# EAGLE design cfg-deb-board (EAGLE 5.11)
DRAWN_BY: Alexios; PROJECT_NAME: CFT Mini-Computer; REVISION: Rev A; SHEET_DESCRIPTION: Debugging Card; SIMULATION_FILENAME: N/A; URL: http://www.bedroomlan.org/cft
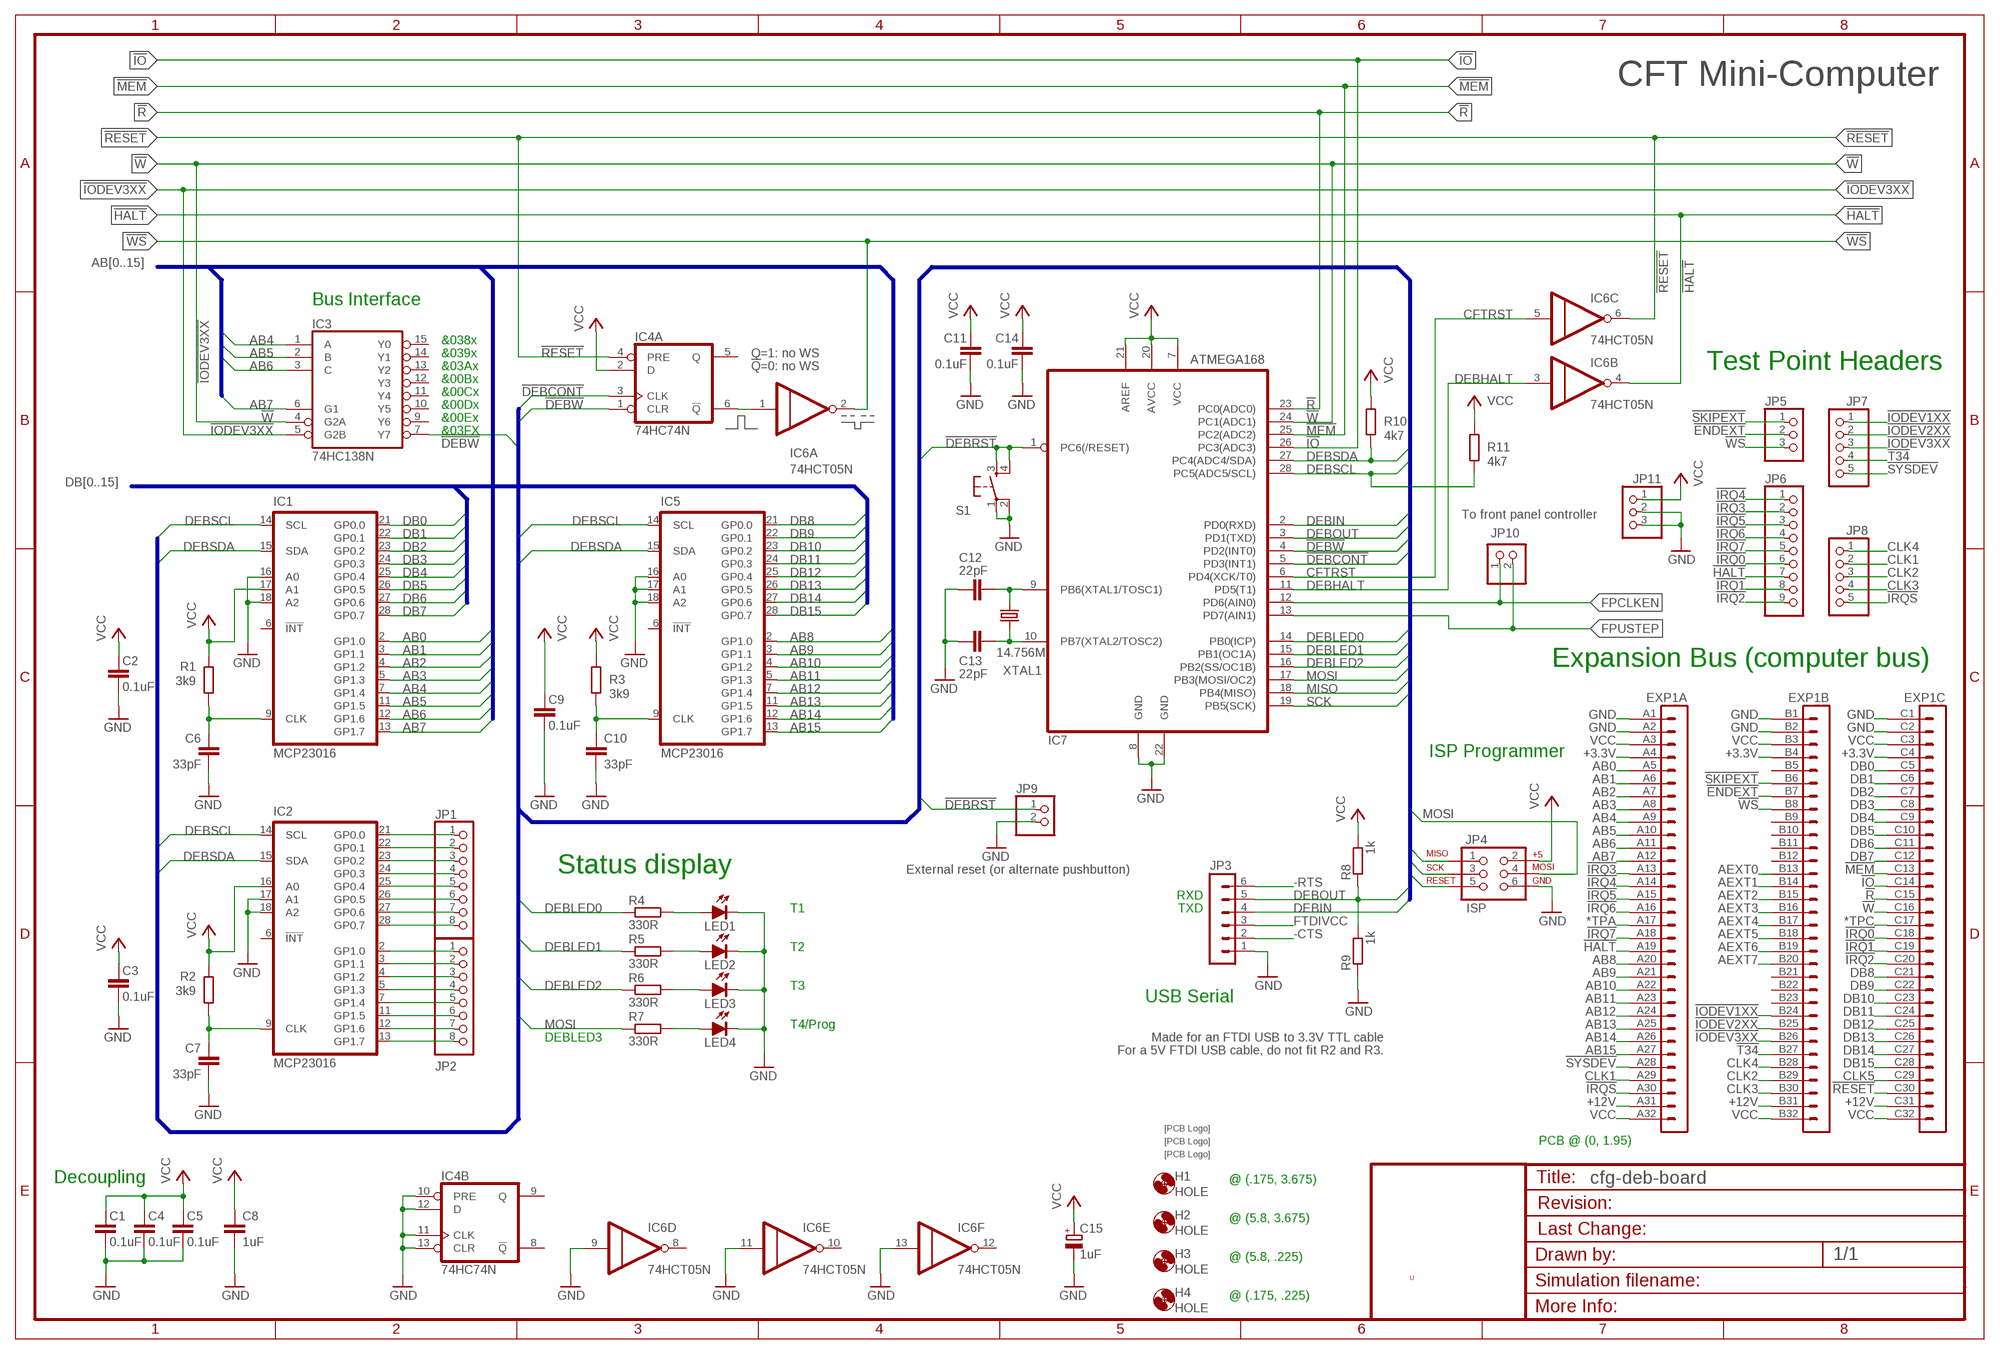
[diagram p0: schematic, sheet 1]

## Parts
C1  0.1uF  C-EU025-024X044  [C025-024X044]
C2  0.1uF  C-EU025-024X044  [C025-024X044]
C3  0.1uF  C-EU025-024X044  [C025-024X044]
C4  0.1uF  C-EU025-024X044  [C025-024X044]
C5  0.1uF  C-EU025-024X044  [C025-024X044]
C6  33pF  C-EU025-024X044  [C025-024X044]
C7  33pF  C-EU025-024X044  [C025-024X044]
C8  1uF  C-EU025-024X044  [C025-024X044]
C9  0.1uF  C-EU025-024X044  [C025-024X044]
C10  33pF  C-EU025-024X044  [C025-024X044]
C11  0.1uF  C-EU025-024X044  [C025-024X044]
C12  22pF  C-EU025-024X044  [C025-024X044]
C13  22pF  C-EU025-024X044  [C025-024X044]
C14  0.1uF  C-EU025-024X044  [C025-024X044]
C15  1uF  CPOL-EUE2.5-5  [E2,5-5]
EXP1  VG96-3K  [VG96K]
H1  HOLE  [STANDOFF_28_60]
H2  HOLE  [STANDOFF_28_60]
H3  HOLE  [STANDOFF_28_60]
H4  HOLE  [STANDOFF_28_60]
IC1  MCP23016  [DIL28-3]
IC2  MCP23016  [DIL28-3]
IC3  74HC138N  [DIL16]
IC4  74HC74N  [DIL14]
IC5  MCP23016  [DIL28-3]
IC6  74HCT05N  [DIL14]
IC7  ATMEGA168  MEGA8-P  [DIL28-3]
JP1  PINHD-1X8  [1X08]
JP2  PINHD-1X8  [1X08]
JP3  MA06-1  [MA06-1]
JP4  ISP  AVR_SPI_PRG_6NS  [2X3-NS]
JP5  PINHD-1X3  [1X03]
JP6  PINHD-1X9  [1X09]
JP7  PINHD-1X5  [1X05]
JP8  PINHD-1X5  [1X05]
JP9  PINHD-1X2  [1X02]
JP10  PINHD-1X2  [1X02]
JP11  PINHD-1X3  [1X03]
LED1  LED-5MM-RED  [LED5MM]
LED2  LED-5MM-RED  [LED5MM]
LED3  LED-5MM-RED  [LED5MM]
LED4  LED-5MM-RED  [LED5MM]
R1  3k9  R-EU_0207/7  [0207/7]
R2  3k9  R-EU_0207/7  [0207/7]
R3  3k9  R-EU_0207/7  [0207/7]
R4  330R  R-EU_0207/7  [0207/7]
R5  330R  R-EU_0207/7  [0207/7]
R6  330R  R-EU_0207/7  [0207/7]
R7  330R  R-EU_0207/7  [0207/7]
R8  1k  R-EU_0207/7  [0207/7]
R9  1k  R-EU_0207/7  [0207/7]
R10  4k7  R-EU_0207/7  [0207/7]
R11  4k7  R-EU_0207/7  [0207/7]
S1  TAC_SWITCHPTH  [TACTILE-PTH]
U$1  SIGNATURESILK  [SIGNATURE]
U$2  SIGNATUREPLANE  [SIGNATURE_PLANE]
U$3  SIGNATUREPLANE  [SIGNATURE_PLANE]
XTAL1  14.756M  CRYSTALHC49U-V  [HC49U-V]

## Nets
!DEBCONT: IC4.3(A:CLK) IC7.5(PD3(INT1))
!DEBRST: IC7.1(PC6(/RESET)) JP4.5 JP9.1 S1.3 S1.4
!DEBW: IC3.7(Y7) IC4.1(A:CLR) IC7.4(PD2(INT0))
!ENDEXT: EXP1.B7 JP5.2
!HALT: EXP1.A19 IC6.4(B:O) JP6.7
!IO: EXP1.C14 IC7.26(PC3(ADC3))
!IODEV1XX: EXP1.B24 JP7.1
!IODEV2XX: EXP1.B25 JP7.2
!IODEV3XX: EXP1.B26 IC3.5(G2B) JP7.3
!IRQ0: EXP1.C18 JP6.6
!IRQ1: EXP1.C19 JP6.8
!IRQ2: EXP1.C20 JP6.9
!IRQ3: EXP1.A13 JP6.2
!IRQ4: EXP1.A14 JP6.1
!IRQ5: EXP1.A15 JP6.3
!IRQ6: EXP1.A16 JP6.4
!IRQ7: EXP1.A18 JP6.5
!IRQS: EXP1.A30 JP8.5
!MEM: EXP1.C13 IC7.25(PC2(ADC2))
!R: EXP1.C15 IC7.23(PC0(ADC0))
!RESET: EXP1.C30 IC4.4(A:PRE) IC6.6(C:O)
!SKIPEXT: EXP1.B6 JP5.1
!SYSDEV: EXP1.A28 JP7.5
!T34: EXP1.B27 JP7.4
!W: EXP1.C16 IC3.4(G2A) IC7.24(PC1(ADC1))
!WS: EXP1.B8 IC6.2(A:O) JP5.3
*TPA: EXP1.A17
*TPC: EXP1.C17
+3.3V: EXP1.A4 EXP1.B4 EXP1.C4
+12V [LED power]: EXP1.A31 EXP1.B31 EXP1.C31
-CTS: JP3.2
-RTS: JP3.6
AB0: EXP1.A5 IC1.2(GP1.0)
AB1: EXP1.A6 IC1.3(GP1.1)
AB2: EXP1.A7 IC1.4(GP1.2)
AB3: EXP1.A8 IC1.5(GP1.3)
AB4: EXP1.A9 IC1.7(GP1.4) IC3.1(A)
AB5: EXP1.A10 IC1.11(GP1.5) IC3.2(B)
AB6: EXP1.A11 IC1.12(GP1.6) IC3.3(C)
AB7: EXP1.A12 IC1.13(GP1.7) IC3.6(G1)
AB8: EXP1.A20 IC5.2(GP1.0)
AB9: EXP1.A21 IC5.3(GP1.1)
AB10: EXP1.A22 IC5.4(GP1.2)
AB11: EXP1.A23 IC5.5(GP1.3)
AB12: EXP1.A24 IC5.7(GP1.4)
AB13: EXP1.A25 IC5.11(GP1.5)
AB14: EXP1.A26 IC5.12(GP1.6)
AB15: EXP1.A27 IC5.13(GP1.7)
AEXT0: EXP1.B13
AEXT1: EXP1.B14
AEXT2: EXP1.B15
AEXT3: EXP1.B16
AEXT4: EXP1.B17
AEXT5: EXP1.B18
AEXT6: EXP1.B19
AEXT7: EXP1.B20
CFTRST: IC6.5(C:I) IC7.6(PD4(XCK/T0))
CLK1: EXP1.A29 JP8.2
CLK2: EXP1.B29 JP8.3
CLK3: EXP1.B30 JP8.4
CLK4: EXP1.B28 JP8.1
CLK5: EXP1.C29
DB0: EXP1.C5 IC1.21(GP0.0)
DB1: EXP1.C6 IC1.22(GP0.1)
DB2: EXP1.C7 IC1.23(GP0.2)
DB3: EXP1.C8 IC1.24(GP0.3)
DB4: EXP1.C9 IC1.25(GP0.4)
DB5: EXP1.C10 IC1.26(GP0.5)
DB6: EXP1.C11 IC1.27(GP0.6)
DB7: EXP1.C12 IC1.28(GP0.7)
DB8: EXP1.C21 IC5.21(GP0.0)
DB9: EXP1.C22 IC5.22(GP0.1)
DB10: EXP1.C23 IC5.23(GP0.2)
DB11: EXP1.C24 IC5.24(GP0.3)
DB12: EXP1.C25 IC5.25(GP0.4)
DB13: EXP1.C26 IC5.26(GP0.5)
DB14: EXP1.C27 IC5.27(GP0.6)
DB15: EXP1.C28 IC5.28(GP0.7)
DEBHALT: IC6.3(B:I) IC7.11(PD5(T1))
DEBIN: IC7.2(PD0(RXD)) JP3.4
DEBLED0: IC7.14(PB0(ICP)) R4.1
DEBLED1: IC7.15(PB1(OC1A)) R5.1
DEBLED2: IC7.16(PB2(SS/OC1B)) R6.1
DEBOUT: IC7.3(PD1(TXD)) JP3.5 R8.1 R9.2
DEBSCL: IC1.14(SCL) IC2.14(SCL) IC5.14(SCL) IC7.28(PC5(ADC5/SCL)) R11.2
DEBSDA: IC1.15(SDA) IC2.15(SDA) IC5.15(SDA) IC7.27(PC4(ADC4/SDA)) R10.2
FPCLKEN: IC7.12(PD6(AIN0)) JP10.1
FPUSTEP: IC7.13(PD7(AIN1)) JP10.2
FTDIVCC: JP3.3
GND [low power]: C1.1 C2.1 C3.1 C4.1 C5.1 C6.2 C7.2 C8.2 C9.1 C10.2 C11.1 C12.2 C13.2 C14.1 C15.- EXP1.A1 EXP1.A2 EXP1.B1 EXP1.B2 EXP1.C1 EXP1.C2 IC1.16(A0) IC1.18(A2) IC2.17(A1) IC2.18(A2) IC4.10(B:PRE) IC4.11(B:CLK) IC4.12(B:D) IC4.13(B:CLR) IC5.16(A0) IC5.17(A1) IC5.18(A2) IC6.9(D:I) IC6.11(E:I) IC6.13(F:I) IC7.8(GND) IC7.22(GND) JP3.1 JP4.6 JP9.2 JP11.2 JP11.3 LED1.K(C) LED2.K(C) LED3.K(C) LED4.K(C) R9.1 S1.1 S1.2
MISO: IC7.18(PB4(MISO)) JP4.1
MOSI: IC7.17(PB3(MOSI/OC2)) JP4.4 R7.1
N$110: C12.1 IC7.9(PB6(XTAL1/TOSC1)) XTAL1.1
N$111: C13.1 IC7.10(PB7(XTAL2/TOSC2)) XTAL1.2
N$112: IC4.6(A:!Q) IC6.1(A:I)
N$114: LED1.A R4.2
N$454: C6.1 IC1.9(CLK) R1.2
N$455: LED2.A R5.2
N$456: C10.1 IC5.9(CLK) R3.2
N$457: C7.1 IC2.9(CLK) R2.2
N$462: IC2.21(GP0.0) JP1.1
N$467: LED3.A R6.2
N$481: LED4.A R7.2
N$539: IC2.22(GP0.1) JP1.2
N$541: IC2.23(GP0.2) JP1.3
N$682: IC2.24(GP0.3) JP1.4
N$686: IC2.25(GP0.4) JP1.5
N$690: IC2.26(GP0.5) JP1.6
N$692: IC2.27(GP0.6) JP1.7
N$693: IC2.28(GP0.7) JP1.8
N$694: IC2.2(GP1.0) JP2.1
N$695: IC2.3(GP1.1) JP2.2
N$697: IC2.4(GP1.2) JP2.3
N$698: IC2.5(GP1.3) JP2.4
N$699: IC2.7(GP1.4) JP2.5
N$845: IC2.11(GP1.5) JP2.6
N$846: IC2.12(GP1.6) JP2.7
N$847: IC2.13(GP1.7) JP2.8
SCK: IC7.19(PB5(SCK)) JP4.3
VCC [low power]: C1.2 C2.2 C3.2 C4.2 C5.2 C8.1 C9.2 C11.2 C14.2 C15.+ EXP1.A3 EXP1.A32 EXP1.B3 EXP1.B32 EXP1.C3 EXP1.C32 IC1.17(A1) IC2.16(A0) IC4.2(A:D) IC7.7(VCC) IC7.20(AVCC) IC7.21(AREF) JP4.2 JP11.1 R1.1 R2.1 R3.1 R8.2 R10.1 R11.1
Unconnected: EXP1.B5 EXP1.B9 EXP1.B10 EXP1.B11 EXP1.B12 EXP1.B21 EXP1.B22 EXP1.B23 IC1.6(!INT) IC2.6(!INT) IC3.9(Y6) IC3.10(Y5) IC3.11(Y4) IC3.12(Y3) IC3.13(Y2) IC3.14(Y1) IC3.15(Y0) IC4.5(A:Q) IC4.8(B:!Q) IC4.9(B:Q) IC5.6(!INT) IC6.8(D:O) IC6.10(E:O) IC6.12(F:O)

## Buses
AB[0..15]
DB[0..15]
!DEBW,!DEBCONT,DEBSCL,DEBSDA,DEBIN,DEBOUT,MOSI,MISO,SCK,!DEBRST,DEBLED[0..3]
!DEBW,!DEBCONT,DEBSCL,DEBSDA,DEBIN,DEBOUT,MOSI,MISO,SCK,!DEBRST,DEBLED[0..3],!R,!W,!MEM,!IO

## Notes on the sheet
- CFT Mini-Computer
- Bus Interface
- &038x
- &039x | Q=1: no WS
- &03Ax | !Q!=0: no WS | Test Point Headers
- &00Bx
- &00Cx
- &00Dx
- &00Ex
- &03FX
- To front panel controller
- Expansion Bus (computer bus)
- ISP Programmer
- Status display | External reset (or alternate pushbutton)
- RXD
- T1 | TXD
- T2
- T3
- USB Serial
- T4/Prog
- DEBLED3 | Made for an FTDI USB to 3.3V TTL cable
- For a 5V FTDI USB cable, do not fit R2 and R3.
- PCB @ (0, 1.95)
- Decoupling | @ (.175, 3.675)
- @ (5.8, 3.675)
- @ (5.8, .225)
- U
- @ (.175, .225)

## Power pins joined to a net without a drawn wire
GND: IC1.1(GND) IC1.8(GND) IC1.19(GND) IC2.1(GND) IC2.8(GND) IC2.19(GND) IC3.8(GND) IC4.7(P:GND) IC5.1(GND) IC5.8(GND) IC5.19(GND) IC6.7(P:GND)
VCC: IC1.20(VCC) IC2.20(VCC) IC3.16(VCC) IC4.14(P:VCC) IC5.20(VCC) IC6.14(P:VCC)

## Library data of the parts
C1-C14 = rcl:C-EU: CAPACITOR, European symbol
C15 = rcl:CPOL-EU: POLARIZED CAPACITOR, European symbol
EXP1 = alexios-19inch:VG96-3: PCB EUROCARD, 96-pin type C/ABC, 2.54 mm
H1-H4 = alexios:HOLE: Hole for a standoff or mount. Hole diameter: 3.3mm. External Diameter: 6mm.
IC1 IC2 IC5 = alexios:MCP23016: 16-bit I²C I/O Expander Datasheet: http://ww1.microchip.com/downloads/en/devicedoc/20090b.pdf
IC3 = 74xx-eu:74*138: 3-line to 8-line DECODER/DEMULTIPLEXER
IC4 = alexios:74*74: Dual D type positive edge triggered FLIP FLOP, preset and clear
IC6 = alexios:74*05: Hex INVERTER, open collector/drain
IC7 = alexios:MEGA8-P: MICROCONTROLLER 8 Kbytes FLASH, 1 kbytes SRAM, 512 bytes EEPROM, USART, 4-channel 10 bit ADC, 2-channel 8 bit ADC Pin compatible with Atmega48, ATMega88, ATMega168 Source: avr.lbr; OC_FARNELL: unknown; OC_NEWARK: unknown
JP1 JP2 = pinhead:PINHD-1X8: PIN HEADER
JP3 = con-lstb:MA06-1: PIN HEADER; OC_FARNELL: unknown; OC_NEWARK: unknown
JP4 = alexios:AVR_SPI_PRG_6: AVR ISP 6 Pin This is the reduced ISP connector for AVR programming. Common on Arduino. This footprint will take up less PCB space and can be used with a 10-pin to 6-pin adapter such as SKU: BOB-08508
JP5 JP11 = pinhead:PINHD-1X3: PIN HEADER
JP6 = pinhead:PINHD-1X9: PIN HEADER
JP7 JP8 = pinhead:PINHD-1X5: PIN HEADER
JP9 JP10 = pinhead:PINHD-1X2: PIN HEADER
LED1-LED4 = alexios:LED-5MM: 5mm LED Standard 5mm LED with filled in diode outline and colour options for the sake of generating bills of materials.
R1-R7 R10 R11 = resistor:R-EU_: RESISTOR, European symbol
R8 R9 = rcl:R-EU_: RESISTOR, European symbol
S1 = SparkFun:TAC_SWITCH: Momentary Switch Button commonly used for reset or general input. Spark Fun Electronics SKU : COM-00097
U$1-U$3 = alexios:SIGNATURE: Soup signature
XTAL1 = crystal:CRYSTAL: CRYSTAL; OC_FARNELL: 1666969; OC_NEWARK: unknown

## Net classes
0 default: width 0.305 mm, clearance 0.203 mm
1 low power: width 1.27 mm, clearance 0.254 mm
2 LED power: width 1.93 mm, clearance 0.254 mm

## Board
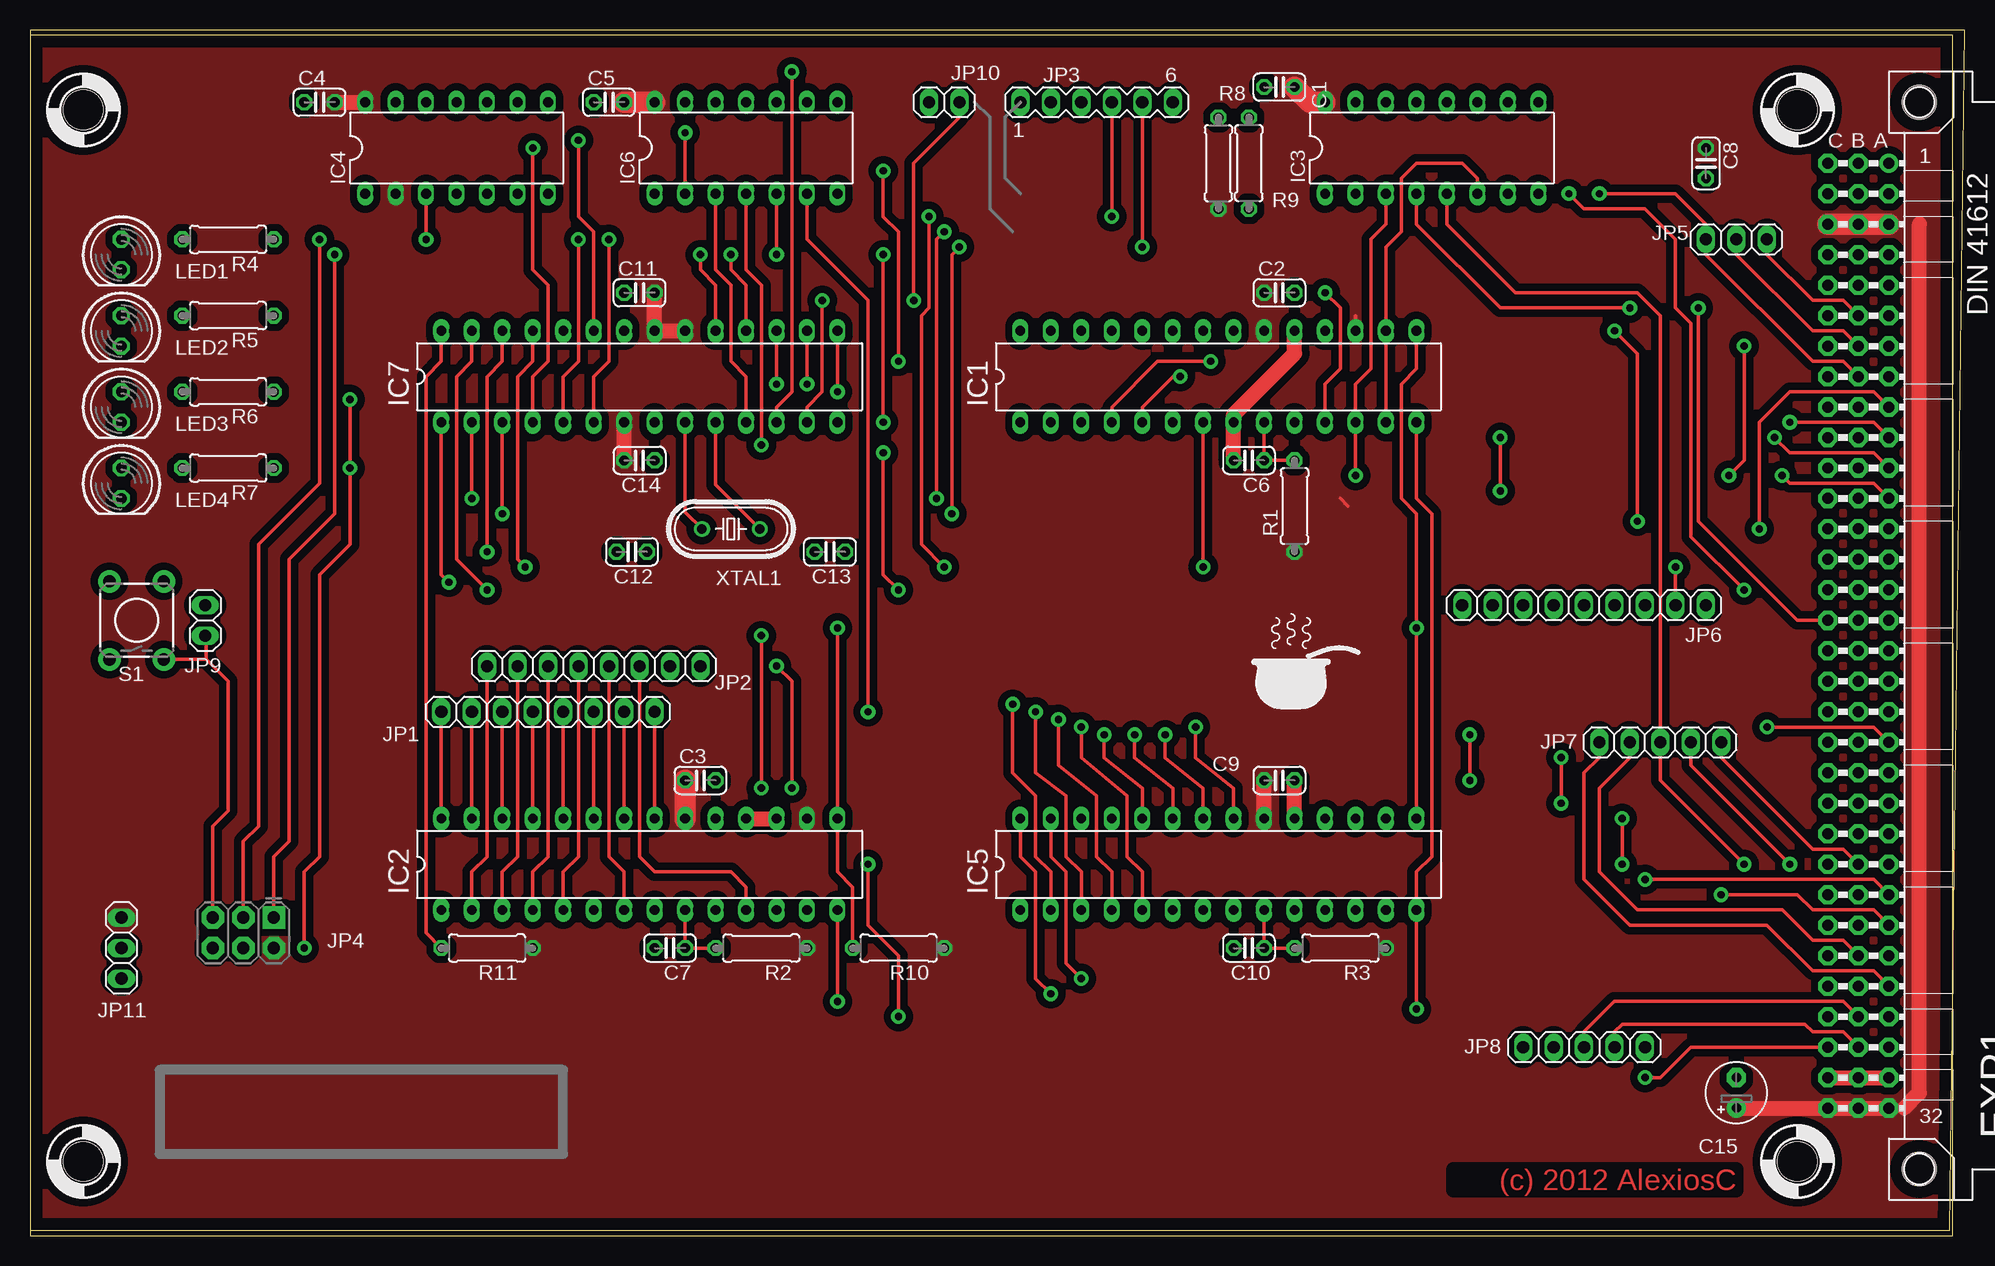
[diagram p1: board, top side]
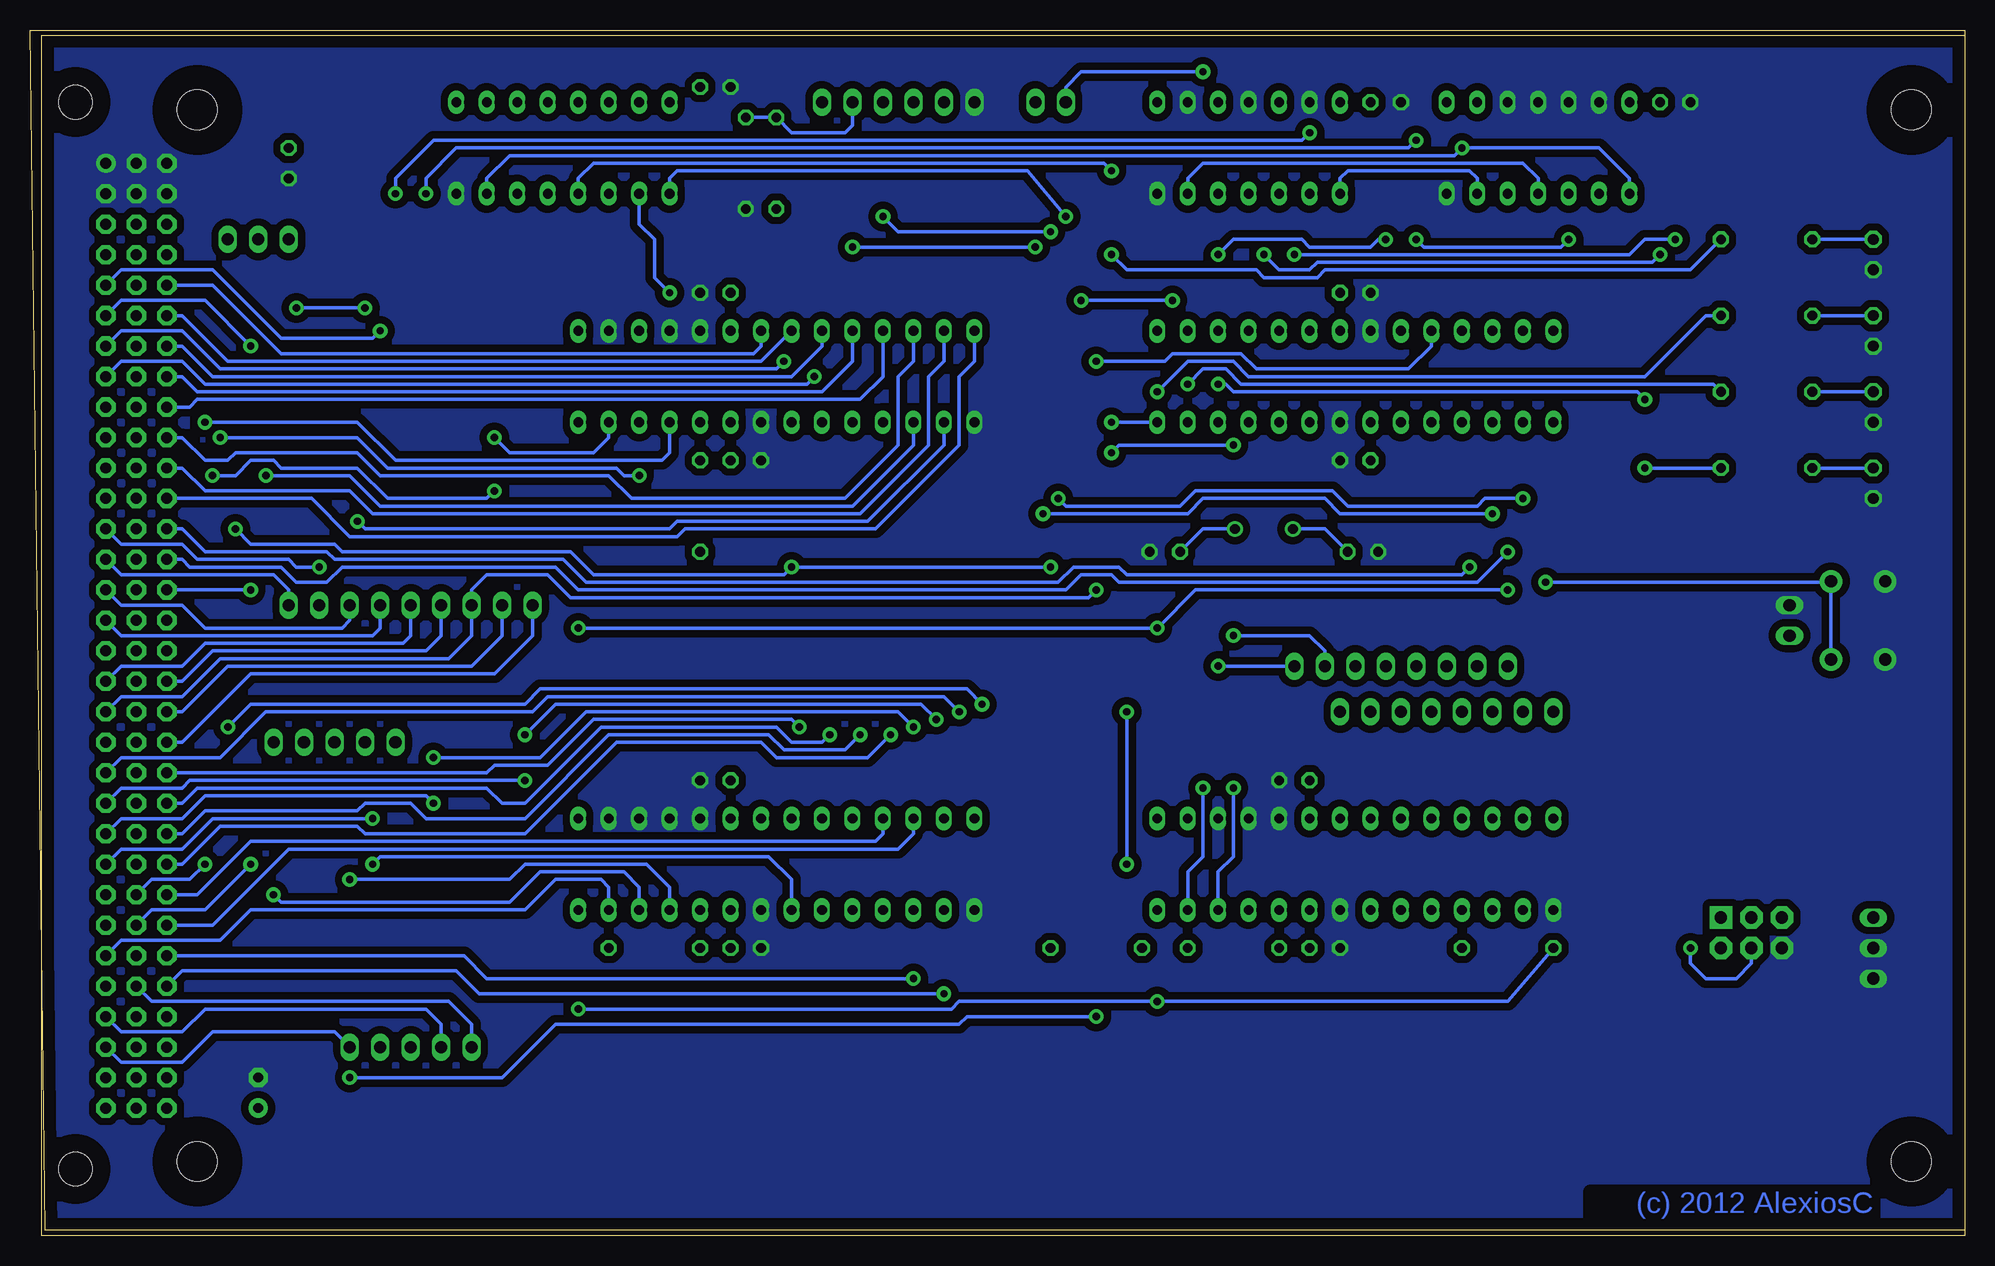
[diagram p2: board, bottom side, seen from below]

Size 161.27 x 100 mm. Coordinates in mm from the lower left corner, seen from the top.
Outline: 0,0 160,0 161.27,100 0,100 0,0
Copper layers (1*16): Top 0.035mm / dielectric 1.5mm / Bottom 0.035mm
Design rules "cft-olimex-10mil-small-pads-tented-vias": minimum track width 10mil, minimum drill 24mil, track to track 10mil, track to pad 10mil, pad to pad 10mil, via to via 10mil, smd to smd 10mil, copper to edge 40mil, drill to drill 10mil, minimum pad ring 10mil, minimum via ring 12mil, stop-mask expansion 4mil, vias tented up to drill 30mil, thermal gap 10mil

### Footprints (pad centres in the part's own frame; a part is rotated, then mirrored left to right if it is on the bottom)
C025-024X044 = drill 0.813 octagon: 1 -1.27,0; 2 1.27,0
E2,5-5 = drill 0.813 pad 1.6 round: + -1.27,0 | drill 0.813 pad 1.6 octagon: - 1.27,0
VG96K = drill 0.914 pad 1.6 round: A1 154.94,39.37 | drill 0.914 pad 1.6 octagon: A2 154.94,36.83; A3 154.94,34.29; A4 154.94,31.75; A5 154.94,29.21; A6 154.94,26.67; A7 154.94,24.13; A8 154.94,21.59; A9 154.94,19.05; A10 154.94,16.51; A11 154.94,13.97; A12 154.94,11.43; A13 154.94,8.89; A14 154.94,6.35; A15 154.94,3.81; A16 154.94,1.27; A17 154.94,-1.27; A18 154.94,-3.81; A19 154.94,-6.35; A20 154.94,-8.89; A21 154.94,-11.43; A22 154.94,-13.97; A23 154.94,-16.51; A24 154.94,-19.05; A25 154.94,-21.59; A26 154.94,-24.13; A27 154.94,-26.67; A28 154.94,-29.21; A29 154.94,-31.75; A30 154.94,-34.29; A31 154.94,-36.83; A32 154.94,-39.37; B1 152.4,39.37; B2 152.4,36.83; B3 152.4,34.29; B4 152.4,31.75; B5 152.4,29.21; B6 152.4,26.67; B7 152.4,24.13; B8 152.4,21.59; B9 152.4,19.05; B10 152.4,16.51; B11 152.4,13.97; B12 152.4,11.43; B13 152.4,8.89; B14 152.4,6.35; B15 152.4,3.81; B16 152.4,1.27; B17 152.4,-1.27; B18 152.4,-3.81; B19 152.4,-6.35; B20 152.4,-8.89; B21 152.4,-11.43; B22 152.4,-13.97; B23 152.4,-16.51; B24 152.4,-19.05; B25 152.4,-21.59; B26 152.4,-24.13; B27 152.4,-26.67; B28 152.4,-29.21; B29 152.4,-31.75; B30 152.4,-34.29; B31 152.4,-36.83; B32 152.4,-39.37; C1 149.86,39.37; C2 149.86,36.83; C3 149.86,34.29; C4 149.86,31.75; C5 149.86,29.21; C6 149.86,26.67; C7 149.86,24.13; C8 149.86,21.59; C9 149.86,19.05; C10 149.86,16.51; C11 149.86,13.97; C12 149.86,11.43; C13 149.86,8.89; C14 149.86,6.35; C15 149.86,3.81; C16 149.86,1.27; C17 149.86,-1.27; C18 149.86,-3.81; C19 149.86,-6.35; C20 149.86,-8.89; C21 149.86,-11.43; C22 149.86,-13.97; C23 149.86,-16.51; C24 149.86,-19.05; C25 149.86,-21.59; C26 149.86,-24.13; C27 149.86,-26.67; C28 149.86,-29.21; C29 149.86,-31.75; C30 149.86,-34.29; C31 149.86,-36.83; C32 149.86,-39.37 | hole 2.794: 157.48,44.45; 157.48,-44.45
STANDOFF_28_60 = hole 3.302: 0,0
DIL28-3 = drill 0.813 long: 1 -16.51,-3.81; 2 -13.97,-3.81; 3 -11.43,-3.81; 4 -8.89,-3.81; 5 -6.35,-3.81; 6 -3.81,-3.81; 7 -1.27,-3.81; 8 1.27,-3.81; 9 3.81,-3.81; 10 6.35,-3.81; 11 8.89,-3.81; 12 11.43,-3.81; 13 13.97,-3.81; 14 16.51,-3.81; 15 16.51,3.81; 16 13.97,3.81; 17 11.43,3.81; 18 8.89,3.81; 19 6.35,3.81; 20 3.81,3.81; 21 1.27,3.81; 22 -1.27,3.81; 23 -3.81,3.81; 24 -6.35,3.81; 25 -8.89,3.81; 26 -11.43,3.81; 27 -13.97,3.81; 28 -16.51,3.81
DIL16 = drill 0.813 long: 1 -8.89,-3.81; 2 -6.35,-3.81; 3 -3.81,-3.81; 4 -1.27,-3.81; 5 1.27,-3.81; 6 3.81,-3.81; 7 6.35,-3.81; 8 8.89,-3.81; 9 8.89,3.81; 10 6.35,3.81; 11 3.81,3.81; 12 1.27,3.81; 13 -1.27,3.81; 14 -3.81,3.81; 15 -6.35,3.81; 16 -8.89,3.81
DIL14 = drill 0.813 long: 1 -7.62,-3.81; 2 -5.08,-3.81; 3 -2.54,-3.81; 4 0,-3.81; 5 2.54,-3.81; 6 5.08,-3.81; 7 7.62,-3.81; 8 7.62,3.81; 9 5.08,3.81; 10 2.54,3.81; 11 0,3.81; 12 -2.54,3.81; 13 -5.08,3.81; 14 -7.62,3.81
1X08 = drill 1.016 long: 1 -8.89,0; 2 -6.35,0; 3 -3.81,0; 4 -1.27,0; 5 1.27,0; 6 3.81,0; 7 6.35,0; 8 8.89,0
MA06-1 = drill 1.016 long: 1 -6.35,0; 2 -3.81,0; 3 -1.27,0; 4 1.27,0; 5 3.81,0; 6 6.35,0
2X3-NS = drill 1.016 pad 1.88 square: 1 -2.54,-1.27 | drill 1.016 pad 1.88 octagon: 2 -2.54,1.27; 3 0,-1.27; 4 0,1.27; 5 2.54,-1.27; 6 2.54,1.27
1X03 = drill 1.016 long: 1 -2.54,0; 2 0,0; 3 2.54,0
1X09 = drill 1.016 long: 1 -10.16,0; 2 -7.62,0; 3 -5.08,0; 4 -2.54,0; 5 0,0; 6 2.54,0; 7 5.08,0; 8 7.62,0; 9 10.16,0
1X05 = drill 1.016 long: 1 -5.08,0; 2 -2.54,0; 3 0,0; 4 2.54,0; 5 5.08,0
1X02 = drill 1.016 long: 1 -1.27,0; 2 1.27,0
LED5MM = drill 0.9 octagon: A -1.27,0; K 1.27,0
0207/7 = drill 0.813 octagon: 1 -3.81,0; 2 3.81,0
TACTILE-PTH = drill 1.016 pad 1.88 round: 1 -3.251,2.261; 2 3.251,2.261; 3 -3.251,-2.261; 4 3.251,-2.261
HC49U-V = drill 0.813 round: 1 -2.413,0; 2 2.413,0

### Placement (x,y rotation side)
C1  104.14,95.25 0 top
C2  104.14,78.11 180 top
C3  55.88,37.47 180 top
C4  24.13,93.98 0 top
C5  48.26,93.98 0 top
C6  101.6,64.14 180 top
C7  53.34,23.5 180 top
C8  139.7,88.9 270 top
C9  104.14,37.47 180 top
C10  101.6,23.5 180 top
C11  50.8,78.11 0 top
C12  50.16,56.52 180 top
C13  66.67,56.52 0 top
C14  50.8,64.14 180 top
C15  142.24,11.43 90 top
EXP1  0,49.53 0 top
H1  4.45,93.34 0 top
H2  147.32,93.34 0 top
H3  147.32,5.71 0 top
H4  4.45,5.71 0 top
IC1  99.06,71.12 0 top
IC2  50.8,30.48 0 top
IC3  116.84,90.17 0 top
IC4  35.56,90.17 0 top
IC5  99.06,30.48 0 top
IC6  59.69,90.17 0 top
IC7  50.8,71.12 0 top
JP1  43.18,43.18 180 top
JP2  46.99,46.99 0 top
JP3  88.9,93.98 0 top
JP4  17.78,24.77 180 top
JP5  142.24,82.55 180 top
JP6  129.54,52.07 180 top
JP7  135.89,40.64 180 top
JP8  129.54,15.24 0 top
JP9  14.61,50.8 90 top
JP10  76.2,93.98 0 top
JP11  7.62,23.5 270 top
LED1  7.62,81.28 270 top
LED2  7.62,74.93 270 top
LED3  7.62,68.58 270 top
LED4  7.62,62.23 270 top
R1  105.41,60.33 90 top
R2  60.96,23.5 180 top
R3  109.22,23.5 180 top
R4  16.51,82.55 180 top
R5  16.51,76.2 180 top
R6  16.51,69.85 180 top
R7  16.51,63.5 180 top
R8  99.06,88.9 270 top
R9  101.6,88.9 90 top
R10  72.39,23.5 180 top
R11  38.1,23.5 180 top
S1  8.89,50.8 90 top
U$1  102.23,43.18 0 top
U$2  -10.16,-43.18 0 top  (outside the outline)
U$3  -10.16,-55.88 0 top  (outside the outline)
XTAL1  58.42,58.42 0 top

### Tracks (layer width: path | path; a pad name or v marks a point on that pad's centre or on a via)
!DEBCONT  (via drill 0.61)
  Top 0.305: v45.72,82.55 45.72,72.39 44.45,71.12 IC7.5 | v33.02,82.55 IC4.3
  Bottom 0.305: v45.72,82.55 45.09,81.92 33.66,81.92 v33.02,82.55
!DEBRST  (via drill 0.61)
  Top 0.305: JP4.5 15.24,33.66 16.51,34.92 16.51,45.72 14.68,47.55 | 14.68,47.55 S1.3 | v34.92,53.98 34.29,54.61 34.29,55.24 IC7.1 | 14.68,47.55 14.68,49.45 JP9.1
  Bottom 0.305: S1.3 S1.4 11.23,53.98 v34.92,53.98
!DEBW  (via drill 0.61)
  Top 0.305: IC7.4 41.91,71.12 43.18,72.39 43.18,78.74 41.91,80.01 v41.91,90.17
  Bottom 0.305: IC3.7 123.19,87.63 121.28,89.53 42.55,89.53 v41.91,90.17 30.48,90.17 27.94,87.63 IC4.1
!ENDEXT
  Top 0.305: EXP1.B7 151.13,74.93 148.59,74.93 142.24,81.28 JP5.2
!HALT  (via drill 0.61)
  Top 0.305: IC6.4 59.69,80.01 60.96,78.74 v60.96,65.41 | v72.39,53.34 71.12,54.61 v71.12,64.77
  Bottom 0.305: EXP1.A19 153.67,44.45 148.59,44.45 145.41,47.62 126.36,47.62 124.46,49.53 JP6.7 124.46,53.34 123.19,54.61 118.11,54.61 116.2,52.7 73.03,52.7 v72.39,53.34 | v71.12,64.77 70.48,65.41 v60.96,65.41
!IO  (via drill 0.61)
  Top 0.305: v38.1,56.52 38.1,71.12 39.37,72.39 IC7.26
  Bottom 0.305: EXP1.C14 148.59,55.88 147.96,55.24 140.34,55.24 139.06,53.98 136.53,53.98 135.25,55.24 117.47,55.24 115.57,53.34 74.93,53.34 73.66,54.61 71.12,54.61 70.48,53.98 40.64,53.98 v38.1,56.52
!IODEV1XX
  Top 0.305: EXP1.B24 151.13,31.75 148.59,31.75 140.97,39.37 JP7.1
!IODEV2XX  (via drill 0.61)
  Top 0.305: v146.69,30.48 138.43,38.73 JP7.2
  Bottom 0.305: EXP1.B25 151.13,29.21 147.96,29.21 v146.69,30.48
!IODEV3XX  (via drill 0.61)
  Top 0.305: IC3.5 118.11,83.82 123.83,78.11 133.99,78.11 135.89,76.2 JP7.3 135.89,37.47 v142.88,30.48
  Bottom 0.305: EXP1.B26 151.13,26.67 146.69,26.67 v142.88,30.48
!IRQ0
  Bottom 0.305: JP6.6 127,49.53 128.27,48.26 146.05,48.26 148.59,45.72 EXP1.C18
!IRQ1
  Bottom 0.305: EXP1.C19 148.59,43.18 144.78,46.99 124.46,46.99 121.92,49.53 JP6.8
!IRQ2
  Bottom 0.305: EXP1.C20 148.59,40.64 142.88,46.35 122.56,46.35 119.38,49.53 JP6.9
!IRQ3  (via drill 0.61)
  Top 0.305: JP6.2 v137.16,55.24
  Bottom 0.305: EXP1.A13 153.67,57.15 148.59,57.15 147.32,55.88 139.7,55.88 139.06,55.24 v137.16,55.24
!IRQ4
  Bottom 0.305: JP6.1 139.7,53.34 140.97,54.61 153.67,54.61 EXP1.A14
!IRQ5
  Bottom 0.305: EXP1.A15 153.67,52.07 148.59,52.07 146.69,50.16 135.25,50.16 134.62,50.8 JP6.3
!IRQ6
  Bottom 0.305: JP6.4 132.08,50.16 132.72,49.53 153.67,49.53 EXP1.A16
!IRQ7
  Bottom 0.305: JP6.5 129.54,49.53 130.18,48.9 146.69,48.9 148.59,46.99 153.67,46.99 EXP1.A18
!IRQS
  Bottom 0.305: JP8.5 135.89,16.51 146.05,16.51 148.59,13.97 153.67,13.97 EXP1.A30
!MEM  (via drill 0.61)
  Top 0.305: IC7.25 41.91,72.39 40.64,71.12 40.64,55.88 v41.27,55.24
  Bottom 0.305: EXP1.C13 148.59,58.42 146.69,56.52 136.53,56.52 135.89,55.88 116.84,55.88 114.94,53.98 75.56,53.98 74.3,55.24 70.48,55.24 69.85,54.61 41.91,54.61 v41.27,55.24
!R  (via drill 0.61)
  Top 0.305: v142.88,53.34 138.43,57.78 138.43,75.56 137.16,76.83 137.16,82.55 134.62,85.09 129.54,85.09 v128.27,86.36 | IC7.23 46.99,83.19 45.72,84.45 v45.72,90.81
  Bottom 0.305: v142.88,53.34 EXP1.C15 | v128.27,86.36 128.27,87.63 125.73,90.17 46.35,90.17 v45.72,90.81
!RESET  (via drill 0.61)
  Top 0.305: v134.62,12.7 135.89,12.7 138.43,15.24 EXP1.C30 | v72.39,17.78 72.39,22.86 69.85,25.4 v69.85,30.48 | v69.85,43.18 69.85,77.47 64.77,82.55 IC6.6
  Bottom 0.305: IC4.4 35.56,87.63 36.83,88.9 63.5,88.9 64.77,87.63 IC6.6 | v72.39,17.78 83.19,17.78 83.82,17.14 117.47,17.14 121.92,12.7 v134.62,12.7 | v69.85,30.48 v69.85,43.18
!SKIPEXT
  Top 0.305: JP5.1 144.78,81.28 148.59,77.47 151.13,77.47 EXP1.B6
!SYSDEV
  Top 0.305: EXP1.A28 153.67,21.59 148.59,21.59 144.78,25.4 133.35,25.4 129.54,29.21 129.54,38.1 130.81,39.37 JP7.5
!T34
  Top 0.305: EXP1.B27 151.13,24.13 148.59,24.13 146.05,26.67 133.99,26.67 130.81,29.84 130.81,36.83 133.35,39.37 JP7.4
!W  (via drill 0.61)
  Top 0.305: v139.06,76.83 139.06,59.05 147.32,50.8 EXP1.C16 | IC3.4 115.57,83.82 122.56,76.83 v133.35,76.83 | v72.39,72.39 72.39,83.19 71.12,84.45 v71.12,88.27
  Bottom 0.305: v71.12,88.27 71.75,88.9 114.3,88.9 115.57,87.63 IC3.4 | v72.39,72.39 66.67,72.39 66.04,73.03 60.33,73.03 59.05,71.75 46.35,71.75 44.45,73.66 IC7.24 | v133.35,76.83 v139.06,76.83
!WS  (via drill 0.61)
  Top 0.305: EXP1.B8 151.13,72.39 148.59,72.39 139.7,81.28 JP5.3 139.7,83.82 137.16,86.36 v130.81,86.36 | IC6.2 v54.61,91.44
  Bottom 0.305: v54.61,91.44 55.24,90.81 127.64,90.81 130.81,87.63 v130.81,86.36
+3.3V
  Top 0.305: EXP1.C4 EXP1.B4 EXP1.A4
+12V
  Top 1.27: EXP1.C31 EXP1.B31 EXP1.A31
AB0  (via drill 0.61)
  Top 0.305: v133.99,59.05 133.99,73.03 v132.08,74.93
  Bottom 0.305: IC1.2 85.09,65.41 91.44,59.05 107.31,59.05 107.95,58.42 133.35,58.42 v133.99,59.05 | EXP1.A5 153.67,80.01 146.05,80.01 140.34,74.3 132.72,74.3 v132.08,74.93
AB1  (via drill 0.61)
  Top 0.305: v142.88,73.66 142.88,64.14 v141.6,62.87
  Bottom 0.305: EXP1.A6 153.67,77.47 146.69,77.47 v142.88,73.66 | IC1.3 87.63,65.41 92.71,60.33 132.08,60.33 134.62,62.87 v141.6,62.87
AB2  (via drill 0.61)
  Top 0.305: IC1.4 90.17,68.58 93.98,72.39 v98.42,72.39
  Bottom 0.305: EXP1.A7 153.67,74.93 148.59,74.93 145.41,71.75 99.06,71.75 v98.42,72.39
AB3  (via drill 0.61)
  Top 0.305: IC1.5 92.71,68.58 95.25,71.12 v95.89,71.12
  Bottom 0.305: EXP1.A8 153.67,72.39 148.59,72.39 146.69,70.48 96.52,70.48 v95.89,71.12
AB4  (via drill 0.61)
  Top 0.305: EXP1.A9 153.67,69.85 146.69,69.85 144.15,67.31 v144.15,58.42 | v74.93,84.45 74.93,76.83 74.3,76.2 74.3,57.15 v76.2,55.24 | v97.79,55.24 IC1.7
  Bottom 0.305: IC3.1 107.95,87.63 107.31,88.27 78.11,88.27 v74.93,84.45 | v144.15,58.42 142.88,57.15 135.89,57.15 135.25,56.52 116.2,56.52 114.3,54.61 98.42,54.61 v97.79,55.24 v76.2,55.24
AB5  (via drill 0.61)
  Top 0.305: IC1.11 107.95,70.48 109.22,71.75 109.22,76.83 v107.95,78.11 | EXP1.A10 153.67,67.31 v146.69,67.31
  Bottom 0.305: v107.95,78.11 109.22,79.38 109.22,82.55 110.49,83.82 IC3.2 | v146.69,67.31 133.99,67.31 130.81,64.14 108.58,64.14 107.95,64.77 IC1.11
AB6  (via drill 0.61)
  Top 0.305: IC3.3 113.03,83.82 111.76,82.55 111.76,71.75 110.49,70.48 IC1.12 v110.49,62.87 | EXP1.A11 153.67,64.77 146.69,64.77 v145.41,66.04
  Bottom 0.305: v110.49,62.87 111.76,62.87 112.39,63.5 131.44,63.5 133.99,66.04 v145.41,66.04
AB7  (via drill 0.61)
  Top 0.305: EXP1.A12 153.67,62.23 146.69,62.23 v146.05,62.87 | v122.56,66.04 v122.56,61.59 | IC3.6 120.65,87.63 119.38,88.9 115.57,88.9 114.3,87.63 114.3,83.19 113.03,81.92 IC1.13
  Bottom 0.305: v146.05,62.87 144.15,62.87 142.88,64.14 140.97,64.14 140.34,63.5 133.99,63.5 131.44,60.96 123.19,60.96 v122.56,61.59 | v122.56,66.04 121.28,64.77 114.3,64.77 113.03,66.04 IC1.13
AB8  (via drill 0.61)
  Top 0.305: IC5.2 85.09,29.84 83.82,31.11 83.82,36.2 81.92,38.1 v81.92,43.81 | EXP1.A20 153.67,41.91 v144.78,41.91
  Bottom 0.305: v144.78,41.91 142.88,43.81 120.02,43.81 118.75,45.09 83.19,45.09 v81.92,43.81
AB9  (via drill 0.61)
  Top 0.305: IC5.3 87.63,29.84 86.36,31.11 86.36,36.2 83.82,38.1 v83.82,43.18
  Bottom 0.305: EXP1.A21 153.67,39.37 145.41,39.37 141.6,43.18 119.38,43.18 118.11,44.45 85.09,44.45 v83.82,43.18
AB10  (via drill 0.61)
  Top 0.305: IC5.4 90.17,29.84 88.9,31.11 88.9,36.2 85.72,38.73 v85.72,42.55 | v120.02,41.27 v120.02,37.47
  Bottom 0.305: v120.02,37.47 147.96,37.47 148.59,36.83 153.67,36.83 EXP1.A22 | v85.72,42.55 87,43.81 117.47,43.81 v120.02,41.27
AB11  (via drill 0.61)
  Top 0.305: v127.64,39.37 v127.64,35.56 | IC5.5 92.71,29.84 91.44,31.11 91.44,36.2 87.63,39.37 v87.63,41.91
  Bottom 0.305: EXP1.A23 153.67,34.29 148.59,34.29 146.69,36.2 128.27,36.2 v127.64,35.56 | v127.64,39.37 118.75,39.37 114.94,43.18 88.9,43.18 v87.63,41.91
AB12  (via drill 0.61)
  Top 0.305: v132.72,30.48 v132.72,34.29
  Bottom 0.305: EXP1.A24 153.67,31.75 148.59,31.75 146.05,34.29 v132.72,34.29 | v132.72,30.48 132.08,31.11 99.69,31.11 97.79,29.21 IC5.7
AB13  (via drill 0.61)
  Top 0.305: v134.62,29.21 153.67,29.21 EXP1.A25
  Bottom 0.305: IC5.11 107.95,28.57 109.86,30.48 120.02,30.48 121.28,29.21 v134.62,29.21
AB14  (via drill 0.61)
  Top 0.305: v140.97,27.94 147.32,27.94 148.59,26.67 153.67,26.67 EXP1.A26
  Bottom 0.305: IC5.12 110.49,28.57 111.76,29.84 118.75,29.84 121.28,27.3 140.34,27.3 v140.97,27.94
AB15
  Bottom 0.305: IC5.13 113.03,28.57 113.67,29.21 117.47,29.21 120.02,26.67 142.88,26.67 145.41,24.13 153.67,24.13 EXP1.A27
CFTRST  (via drill 0.61)
  Top 0.305: IC7.6 46.99,71.12 48.26,72.39 v48.26,82.55 | v62.23,81.28 IC6.5
  Bottom 0.305: v48.26,82.55 48.9,82.55 49.53,81.92 54.61,81.92 55.24,82.55 60.96,82.55 v62.23,81.28
CLK1
  Bottom 0.305: JP8.2 127,17.14 128.27,18.41 146.69,18.41 148.59,16.51 153.67,16.51 EXP1.A29
CLK2
  Top 0.305: JP8.3 129.54,16.51 132.08,19.05 151.13,19.05 EXP1.B29
CLK3
  Top 0.305: JP8.4 132.08,16.51 132.72,17.14 147.96,17.14 148.59,16.51 151.13,16.51 EXP1.B30
CLK4
  Bottom 0.305: JP8.1 124.46,17.14 126.36,19.05 151.13,19.05 EXP1.B28
DB0
  Bottom 0.305: IC1.21 100.33,73.66 100.97,73.03 140.34,73.03 146.05,78.74 EXP1.C5
DB1
  Bottom 0.305: EXP1.C6 148.59,76.2 144.78,72.39 100.33,72.39 IC1.22
DB2
  Bottom 0.305: IC1.23 95.25,73.66 97.79,71.12 146.05,71.12 148.59,73.66 EXP1.C7
DB3
  Bottom 0.305: EXP1.C8 148.59,71.12 147.32,69.85 95.25,69.85 92.71,72.39 IC1.24
DB4
  Bottom 0.305: IC1.25 90.17,71.12 92.08,69.22 147.32,69.22 147.96,68.58 EXP1.C9
DB5
  Bottom 0.305: EXP1.C10 148.59,66.04 146.69,64.14 144.78,64.14 144.15,64.77 133.99,64.77 132.08,62.87 113.03,62.87 111.12,60.96 93.34,60.96 88.9,65.41 88.9,71.12 87.63,72.39 IC1.26
DB6
  Bottom 0.305: EXP1.C11 148.59,63.5 146.69,61.59 134.62,61.59 132.72,59.69 92.08,59.69 86.36,65.41 86.36,71.12 85.09,72.39 IC1.27
DB7
  Bottom 0.305: EXP1.C12 137.79,60.96 134.62,57.78 107.31,57.78 106.68,58.42 90.81,58.42 83.82,65.41 83.82,71.12 82.55,72.39 IC1.28
DB8  (via drill 0.61)
  Top 0.305: IC5.21 100.33,36.83 97.16,39.37 v97.16,41.91
  Bottom 0.305: EXP1.C21 123.19,38.1 122.56,38.73 118.11,38.73 114.3,42.55 97.79,42.55 v97.16,41.91
DB9  (via drill 0.61)
  Top 0.305: IC5.22 97.79,36.83 94.61,39.37 v94.61,41.27
  Bottom 0.305: EXP1.C22 148.59,35.56 147.32,36.83 123.19,36.83 121.92,35.56 120.02,35.56 113.67,41.91 99.06,41.91 97.79,40.64 95.25,40.64 v94.61,41.27
DB10  (via drill 0.61)
  Top 0.305: IC5.23 95.25,36.83 92.08,39.37 v92.08,41.27
  Bottom 0.305: EXP1.C23 148.59,33.02 146.69,34.92 133.99,34.92 133.35,35.56 129.54,35.56 128.27,34.29 120.02,34.29 113.03,41.27 99.69,41.27 98.42,40.01 93.34,40.01 v92.08,41.27
DB11  (via drill 0.61)
  Top 0.305: IC5.24 92.71,36.83 89.53,39.37 v89.53,41.27
  Bottom 0.305: EXP1.C24 148.59,30.48 145.41,33.66 133.99,33.66 133.35,33.02 120.02,33.02 112.39,40.64 100.33,40.64 99.06,39.37 91.44,39.37 v89.53,41.27
DB12
  Bottom 0.305: EXP1.C25 147.32,27.94 142.88,32.38 90.81,32.38 90.17,33.02 IC5.25
DB13
  Bottom 0.305: EXP1.C26 146.05,25.4 139.7,31.75 88.9,31.75 87.63,33.02 IC5.26
DB14  (via drill 0.61)
  Top 0.305: IC5.27 85.09,31.11 86.36,29.84 86.36,22.23 v87.63,20.95
  Bottom 0.305: EXP1.C27 125.09,22.86 123.19,20.95 v87.63,20.95
DB15  (via drill 0.61)
  Top 0.305: IC5.28 82.55,31.11 83.82,29.84 83.82,20.95 v85.09,19.68
  Bottom 0.305: EXP1.C28 148.59,21.59 125.73,21.59 123.83,19.68 v85.09,19.68
DEBHALT
  Top 0.305: IC6.3 57.15,80.01 58.42,78.74 58.42,72.39 59.69,71.12 IC7.11
DEBIN  (via drill 0.61)
  Top 0.305: v76.2,83.19 75.56,82.55 v75.56,60.96 | v36.83,60.96 IC7.2 | v90.17,84.45 JP3.4
  Bottom 0.305: v75.56,60.96 74.93,60.33 65.41,60.33 64.14,61.59 52.7,61.59 51.44,60.33 40.64,60.33 40.01,60.96 v36.83,60.96 | v76.2,83.19 88.9,83.19 v90.17,84.45
DEBLED0  (via drill 0.61)
  Top 0.305: v71.12,81.28 v71.12,67.31
  Bottom 0.305: v71.12,67.31 IC7.14 | v71.12,81.28 69.85,80.01 59.05,80.01 58.42,79.38 53.98,79.38 53.34,80.01 22.86,80.01 R4.1
DEBLED1  (via drill 0.61)
  Top 0.305: v67.31,69.85 IC7.15
  Bottom 0.305: R5.1 21.59,76.2 26.67,71.12 59.69,71.12 60.96,72.39 64.77,72.39 v67.31,69.85
DEBLED2  (via drill 0.61)
  Top 0.305: v64.77,70.48 IC7.16
  Bottom 0.305: R6.1 20.95,70.48 60.33,70.48 61.59,71.75 63.5,71.75 v64.77,70.48
DEBOUT  (via drill 0.61)
  Top 0.305: v77.47,81.92 76.83,81.28 v76.83,59.69 | v39.37,59.69 IC7.3 | v92.71,81.92 JP3.5
  Bottom 0.305: R9.2 R8.1 97.79,91.44 93.34,91.44 92.71,92.08 JP3.5 | v39.37,59.69 52.07,59.69 53.34,60.96 63.5,60.96 64.77,59.69 v76.83,59.69 | v77.47,81.92 v92.71,81.92
DEBSCL  (via drill 0.61)
  Top 0.305: IC1.14 115.57,60.96 116.84,59.69 116.84,31.11 115.57,29.84 IC5.14 v115.57,18.41 | IC7.28 34.29,72.39 33.02,71.12 33.02,24.77 R11.2 | v67.31,19.05 IC2.14
  Bottom 0.305: v115.57,18.41 84.45,18.41 83.82,19.05 v67.31,19.05 38.1,19.05 R11.2
DEBSDA  (via drill 0.61)
  Top 0.305: v67.31,50.16 IC2.15 67.31,29.84 68.58,28.57 R10.2 | IC1.15 115.57,71.75 114.3,70.48 114.3,60.96 115.57,59.69 v115.57,50.16 IC5.15 | IC7.27 36.83,72.39 35.56,71.12 35.56,55.88 v38.1,53.34
  Bottom 0.305: v115.57,50.16 v67.31,50.16 64.14,53.34 v38.1,53.34
FPCLKEN  (via drill 0.61)
  Top 0.305: IC7.12 62.23,68.58 63.5,69.85 v63.5,96.52
  Bottom 0.305: v63.5,96.52 73.66,96.52 74.93,95.25 JP10.1
FPUSTEP  (via drill 0.61)
  Top 0.305: IC7.13 64.77,68.58 66.04,69.85 v66.04,77.47 | v73.66,77.47 73.66,88.9 77.47,92.71 JP10.2
  Bottom 0.305: v66.04,77.47 v73.66,77.47
GND
  Top 1.27: IC2.18 IC2.17 | IC5.19 C9.1 | C6.2 IC1.8 100.33,67.94 105.41,73.03 IC1.19
  pour Bottom (isolate 0.61, no thermals): 0,100.33 0,0 160.02,0 160.02,100.33
MISO  (via drill 0.61)
  Top 0.305: IC7.18 59.69,78.74 58.42,80.01 v58.42,81.28 | v25.4,81.28 25.4,59.69 21.59,55.88 21.59,32.38 20.32,31.11 JP4.1
  Bottom 0.305: v58.42,81.28 57.15,80.01 54.61,80.01 53.98,80.64 26.04,80.64 v25.4,81.28
MOSI  (via drill 0.61)
  Top 0.305: v62.23,70.48 IC7.17 | v22.86,23.5 22.86,29.84 24.13,31.11 24.13,54.61 26.67,57.15 v26.67,63.5 v26.67,69.22
  Bottom 0.305: v26.67,69.22 27.3,69.85 60.96,69.85 61.59,70.48 v62.23,70.48 | JP4.4 17.78,22.23 19.05,20.95 21.59,20.95 22.86,22.23 v22.86,23.5 | v26.67,63.5 R7.1
N$110
  Top 0.305: IC7.9 54.61,59.82 XTAL1.1
  Bottom 0.305: C12.1 53.34,58.42 XTAL1.1
N$111
  Top 0.305: IC7.10 57.15,62.1 XTAL1.2
  Bottom 0.305: XTAL1.2 63.5,58.42 C13.1
N$112
  Bottom 0.305: IC4.6 40.64,87.63 41.27,88.27 51.44,88.27 52.07,87.63 IC6.1
N$114
  Bottom 0.305: LED1.A R4.2
N$454
  Top 0.305: IC1.9 C6.1 R1.2
N$455
  Bottom 0.305: LED2.A R5.2
N$456
  Top 0.305: IC5.9 C10.1 R3.2
N$457
  Top 0.305: IC2.9 C7.1 R2.2
N$462
  Top 0.305: IC2.21 JP1.1
N$467
  Bottom 0.305: LED3.A R6.2
N$481
  Bottom 0.305: LED4.A R7.2
N$539
  Top 0.305: IC2.22 JP1.2
N$541
  Top 0.305: IC2.23 JP1.3
N$682
  Top 0.305: IC2.24 JP1.4
N$686
  Top 0.305: IC2.25 JP1.5
N$690
  Top 0.305: IC2.26 JP1.6
N$692
  Top 0.305: IC2.27 JP1.7
N$693
  Top 0.305: IC2.28 JP1.8
N$694
  Top 0.305: IC2.2 36.83,29.84 38.1,31.11 JP2.1
N$695
  Top 0.305: IC2.3 39.37,29.84 40.64,31.11 JP2.2
N$697
  Top 0.305: IC2.4 41.91,29.84 43.18,31.11 JP2.3
N$698
  Top 0.305: IC2.5 44.45,29.84 45.72,31.11 JP2.4
N$699
  Top 0.305: IC2.7 49.53,29.84 48.26,31.11 JP2.5
N$845
  Top 0.305: JP2.6 50.8,31.11 52.07,29.84 58.42,29.84 59.69,28.57 IC2.11
N$846  (via drill 0.61)
  Top 0.305: v60.96,36.83 v60.96,49.53
  Bottom 0.305: IC2.12 62.23,29.84 60.96,31.11 v60.96,36.83 | v60.96,49.53 54.61,49.53 53.34,48.26 JP2.7
N$847  (via drill 0.61)
  Top 0.305: v63.5,36.83 63.5,45.72 v62.23,46.99
  Bottom 0.305: IC2.13 64.77,29.84 63.5,31.11 v63.5,36.83 | v62.23,46.99 JP2.8
SCK  (via drill 0.61)
  Top 0.305: v24.13,82.55 24.13,62.23 19.05,57.15 19.05,33.66 17.78,32.38 JP4.3 | v55.88,81.28 55.88,80.01 57.15,78.74 IC7.19
  Bottom 0.305: v24.13,82.55 26.67,82.55 27.94,81.28 v55.88,81.28
VCC
  Top 0.305: 109.86,60.33 109.22,60.96 | IC1.17 110.49,76.2
  Top 1.27: C15.+ EXP1.C32 EXP1.B32 EXP1.A32 | IC5.20 C9.2 | C14.2 IC7.7 | C11.2 IC7.21 IC7.20 | C4.2 IC4.14 | 157.48,83.82 157.48,11.43 156.21,10.16
  Top 1.778: EXP1.C3 EXP1.B3 EXP1.A3 | IC2.20 C3.2 | C1.2 106.68,93.98 IC3.16 | C5.2 IC6.14
  pour Top (isolate 0.61, no thermals): 0,100.33 0,0 160.02,0 160.02,100.33

### Text on the board
Top: (c) 2012 AlexiosC
Bottom: (c) 2012 AlexiosC
tDocu: FPCLKEN | FPUSTEP | GND | RXD | TXD | TTL Serial | Addr decode | Front Panel | A | !WS | !ENDEXT | !SKIPEXT | B | C | MCU | LSB GPIO | D | Prog | !IRQ2 | !IRQ1 | !HALT | !IRQ0 | !IRQ7 | !IRQ6 | !IRQ5 | !IRQ3 | !IRQ4 | (c) 2012 AlexiosC | 1 | 2 | 3 | 4 | 5 | 6 | 7 | 8 | POD A | Reset | POD B | 8 | 7 | 6 | 5 | 4 | 3 | 2 | 1 | !SYSDEV | !T34 | !IODEV3xx | !IODEV2xx | !IODEV1xx | !RESET | SCK | MISO | +5V | GND | MSB GPIO | GND | MOSI | +5V | GND | User GPIO | CLK4 | CLK1 | CLK2 | CLK3 | !IRQS | ISP Programmer | CAUTION: Flash MCU | with computer HALTED! | CFT In-Circuit Debugger/Unit Tester Rev A | http://www.bedroomlan.org/cft